# EAGLE design interface visual (EAGLE 7.6.0)
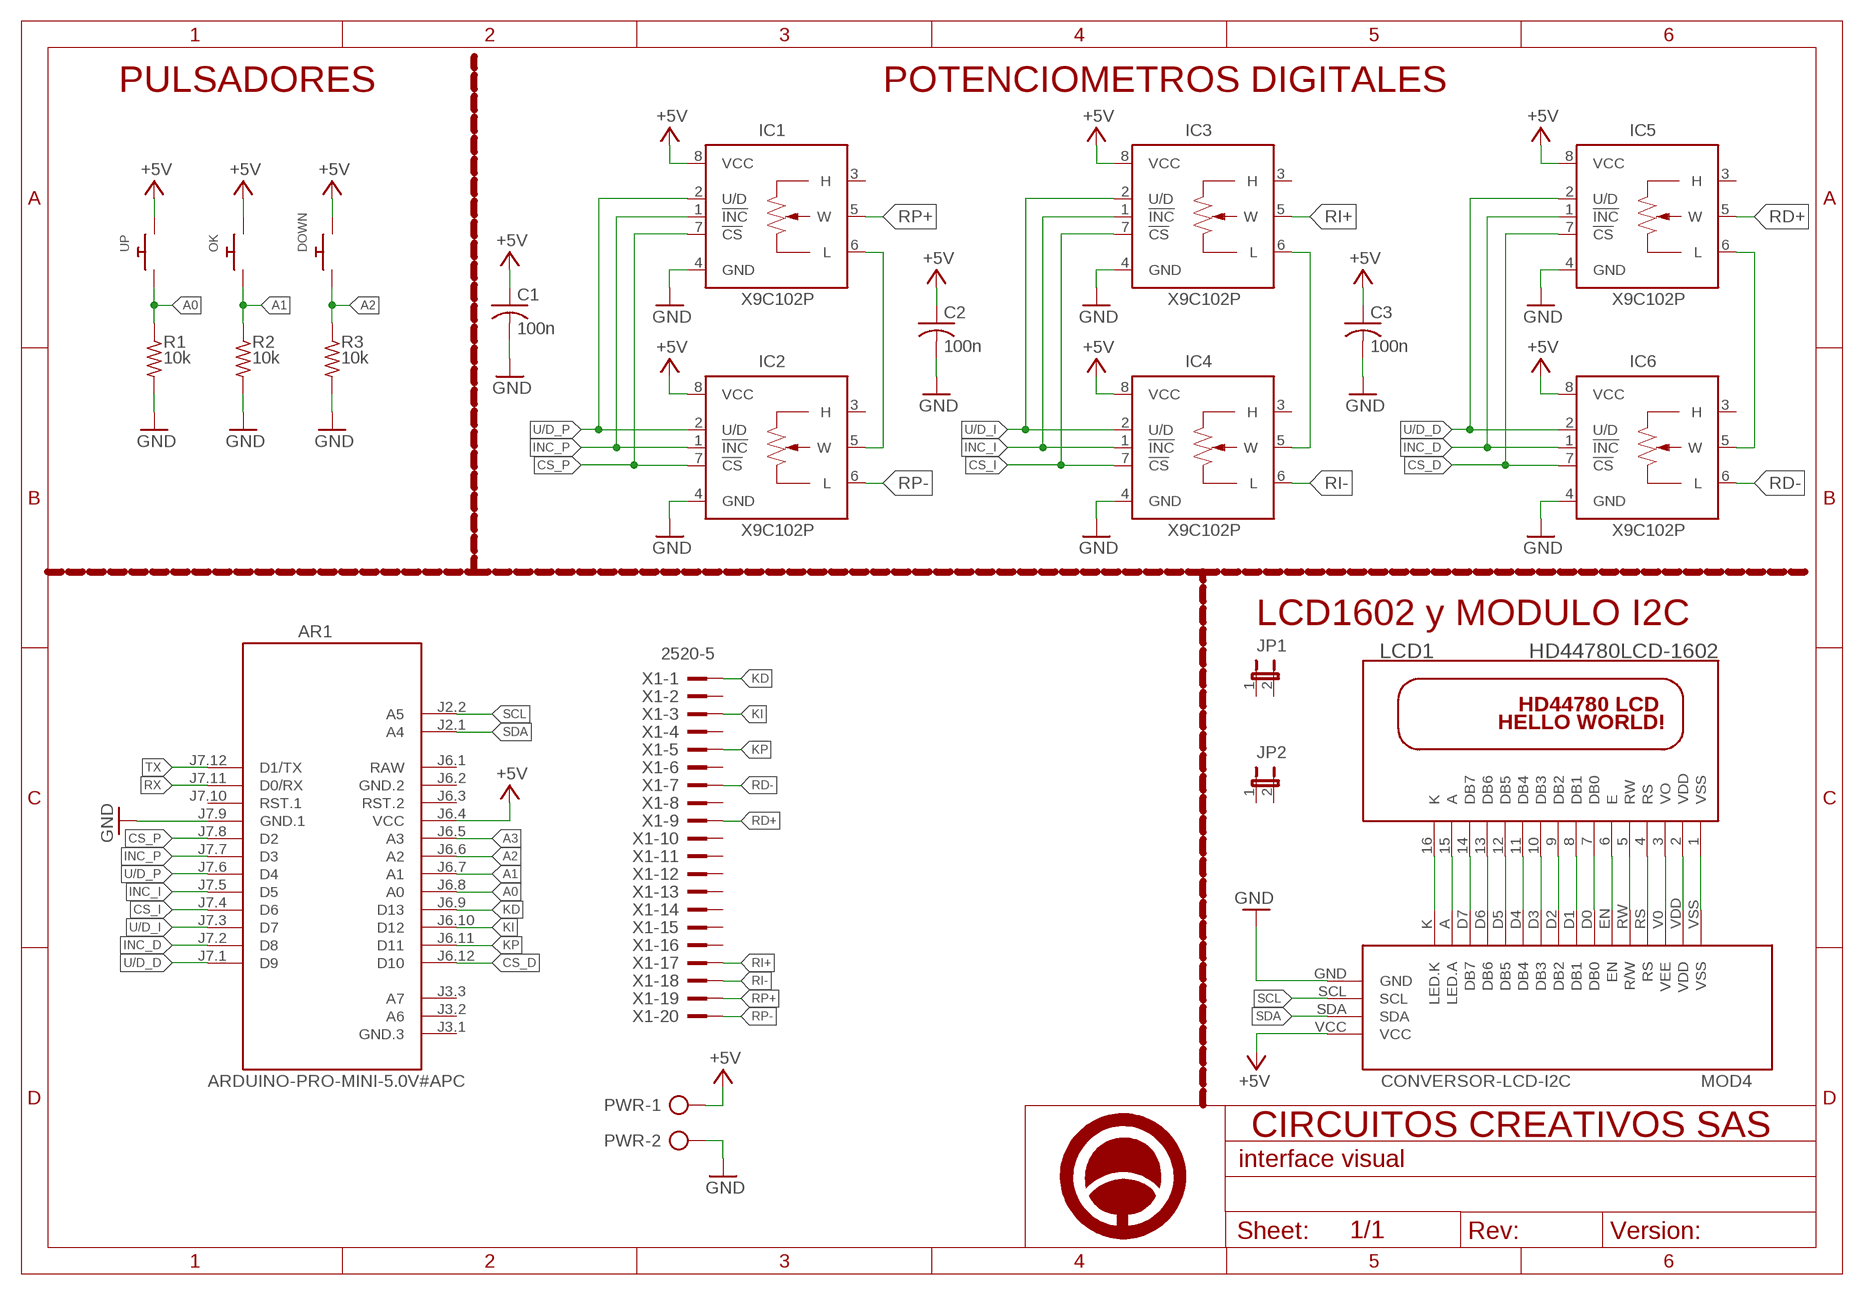
[diagram p0: schematic, sheet 1]

## Parts
AR1  ARDUINO-PRO-MINI-5.0V#APC  [ARDUINO-PRO-MINI#APC]
C1  100n  C-US025-025X050  [C025-025X050]
C2  100n  C-US025-025X050  [C025-025X050]
C3  100n  C-US025-025X050  [C025-025X050]
DOWN  SWITCH_PUSHBUTTONEVQ-PE  [TACT_PANA-EVQ]
IC1  X9C102P  [DIL08]
IC2  X9C102P  [DIL08]
IC3  X9C102P  [DIL08]
IC4  X9C102P  [DIL08]
IC5  X9C102P  [DIL08]
IC6  X9C102P  [DIL08]
JP1  JP1E  [JP1]
JP2  JP1E  [JP1]
LCD1  HD44780LCD-1602  [LCD1602]
MOD4  CONVERSOR-LCD-I2C  [CONVERSOR-LCD-I2C]
OK  SWITCH_PUSHBUTTONEVQ-PE  [TACT_PANA-EVQ]
PWR  AK500/2  [AK500/2]
R1  10k  R-US_0204/7  [0204/7]
R2  10k  R-US_0204/7  [0204/7]
R3  10k  R-US_0204/7  [0204/7]
U$1  A4_HORIZONTAL  [LOGO]
UP  SWITCH_PUSHBUTTONEVQ-PE  [TACT_PANA-EVQ]
X1  2520-5  [PAK100/2500-5-20]

## Nets
+5V: AR1.J6.4(VCC) C1.1 C2.1 C3.1 DOWN.P$2 IC1.8(VCC) IC2.8(VCC) IC3.8(VCC) IC4.8(VCC) IC5.8(VCC) IC6.8(VCC) MOD4.VCC OK.P$2 PWR.1 UP.P$2
A0: AR1.J6.8(A0) R1.1 UP.P$1
A1: AR1.J6.7(A1) OK.P$1 R2.1
A2: AR1.J6.6(A2) DOWN.P$1 R3.1
A3: AR1.J6.5(A3)
CS_D: AR1.J6.12(D10) IC5.7(!CS) IC6.7(!CS)
CS_I: AR1.J7.4(D6) IC3.7(!CS) IC4.7(!CS)
CS_P: AR1.J7.8(D2) IC1.7(!CS) IC2.7(!CS)
GND: AR1.J7.9(GND.1) C1.2 C2.2 C3.2 IC1.4(GND) IC2.4(GND) IC3.4(GND) IC4.4(GND) IC5.4(GND) IC6.4(GND) MOD4.GND PWR.2 R1.2 R2.2 R3.2
INC_D: AR1.J7.2(D8) IC5.1(!INC) IC6.1(!INC)
INC_I: AR1.J7.5(D5) IC3.1(!INC) IC4.1(!INC)
INC_P: AR1.J7.7(D3) IC1.1(!INC) IC2.1(!INC)
KD: AR1.J6.9(D13) X1.1
KI: AR1.J6.10(D12) X1.3
KP: AR1.J6.11(D11) X1.5
N$1: IC3.6(L) IC4.5(W)
N$2: IC1.6(L) IC2.5(W)
N$20: IC5.6(L) IC6.5(W)
N$34: LCD1.3(VO) MOD4.V0(VEE)
N$35: LCD1.4(RS) MOD4.RS
N$36: LCD1.5(RW) MOD4.RW(R/W)
N$37: LCD1.7(DB0) MOD4.D0(DB0)
N$38: LCD1.6(E) MOD4.EN
N$39: LCD1.8(DB1) MOD4.D1(DB1)
N$40: LCD1.9(DB2) MOD4.D2(DB2)
N$41: LCD1.10(DB3) MOD4.D3(DB3)
N$42: LCD1.11(DB4) MOD4.D4(DB4)
N$43: LCD1.12(DB5) MOD4.D5(DB5)
N$44: LCD1.13(DB6) MOD4.D6(DB6)
N$45: LCD1.14(DB7) MOD4.D7(DB7)
N$46: LCD1.15(A) MOD4.A(LED.A)
N$47: LCD1.16(K) MOD4.K(LED.K)
RD+: IC5.5(W) X1.9
RD-: IC6.6(L) X1.7
RI+: IC3.5(W) X1.17
RI-: IC4.6(L) X1.18
RP+: IC1.5(W) X1.19
RP-: IC2.6(L) X1.20
RX: AR1.J7.11(D0/RX)
SCL: AR1.J2.2(A5) MOD4.SCL
SDA: AR1.J2.1(A4) MOD4.SDA
TX: AR1.J7.12(D1/TX)
U/D_D: AR1.J7.1(D9) IC5.2(U/D) IC6.2(U/D)
U/D_I: AR1.J7.3(D7) IC3.2(U/D) IC4.2(U/D)
U/D_P: AR1.J7.6(D4) IC1.2(U/D) IC2.2(U/D)
VDD: LCD1.2(VDD) MOD4.VDD
VSS: LCD1.1(VSS) MOD4.VSS
Unconnected: AR1.J3.1(GND.3) AR1.J3.2(A6) AR1.J3.3(A7) AR1.J6.3(RST.2) AR1.J7.10(RST.1) IC1.3(H) IC2.3(H) IC3.3(H) IC4.3(H) IC5.3(H) IC6.3(H) JP1.1 JP1.2 JP2.1 JP2.2 X1.2 X1.4 X1.6 X1.8 X1.10 X1.11 X1.12 X1.13 X1.14 X1.15 X1.16

## Notes on the sheet
- PULSADORES | POTENCIOMETROS DIGITALES
- LCD1602 y MODULO I2C

## Power pins joined to a net without a drawn wire
GND.2: AR1.J6.2(GND.2)
RAW: AR1.J6.1(RAW)

## Library data of the parts
AR1 = DIY- comercial modules:ARDUINO-PRO-MINI-*#APC: Arduino Pro Mini (and compatible devices) with angle programming connector More details available here: https://www.arduino.cc/en/Main/ArduinoBoardProMini Click here to find device on ebay.com <http://www.ebay.com/sch/arduino+pro+mini>
C1-C3 = rcl:C-US: CAPACITOR, American symbol
DOWN OK UP = adafruit:SWITCH_PUSHBUTTON: Buttons SOFTTOUCHSMD_SJ - Soft touch temporary push button (Super Junk Akihabara) Compatible with SKPMANE010 [Mouser: 688-SKPMAN] C&K_KSS = Digikey: KSS221GLFS
IC1-IC6 = pot-xicor:X9C102*: Digital POTENTIOMETER; MF: INTERSIL; MPN: X9C102P; OC_FARNELL: 1216104; OC_NEWARK: 51J6928
JP1 JP2 = jumper:JP1E: JUMPER
LCD1 = adafruit:HD44780LCD: HD44780 LCD Standard character type LCDs, available in sizes from 8x1 to 40x4!
MOD4 = Ciruitos-Creativos-Modulos:CONVERSOR-LCD-I2C
PWR = con-ptr500:AK500/2: CONNECTOR; OC_FARNELL: unknown; OC_NEWARK: unknown
R1-R3 = resistor:R-US_: RESISTOR, American symbol
U$1 = Circuitos-Creativos-Estilos:A4_HORIZONTAL
X1 = con-3m:2520-: 3M (TM) Pak 100 4-Wall Header Source: 3M; MPN: D2520-5002-AR; OC_FARNELL: unknown; OC_NEWARK: 12P7058

## Board
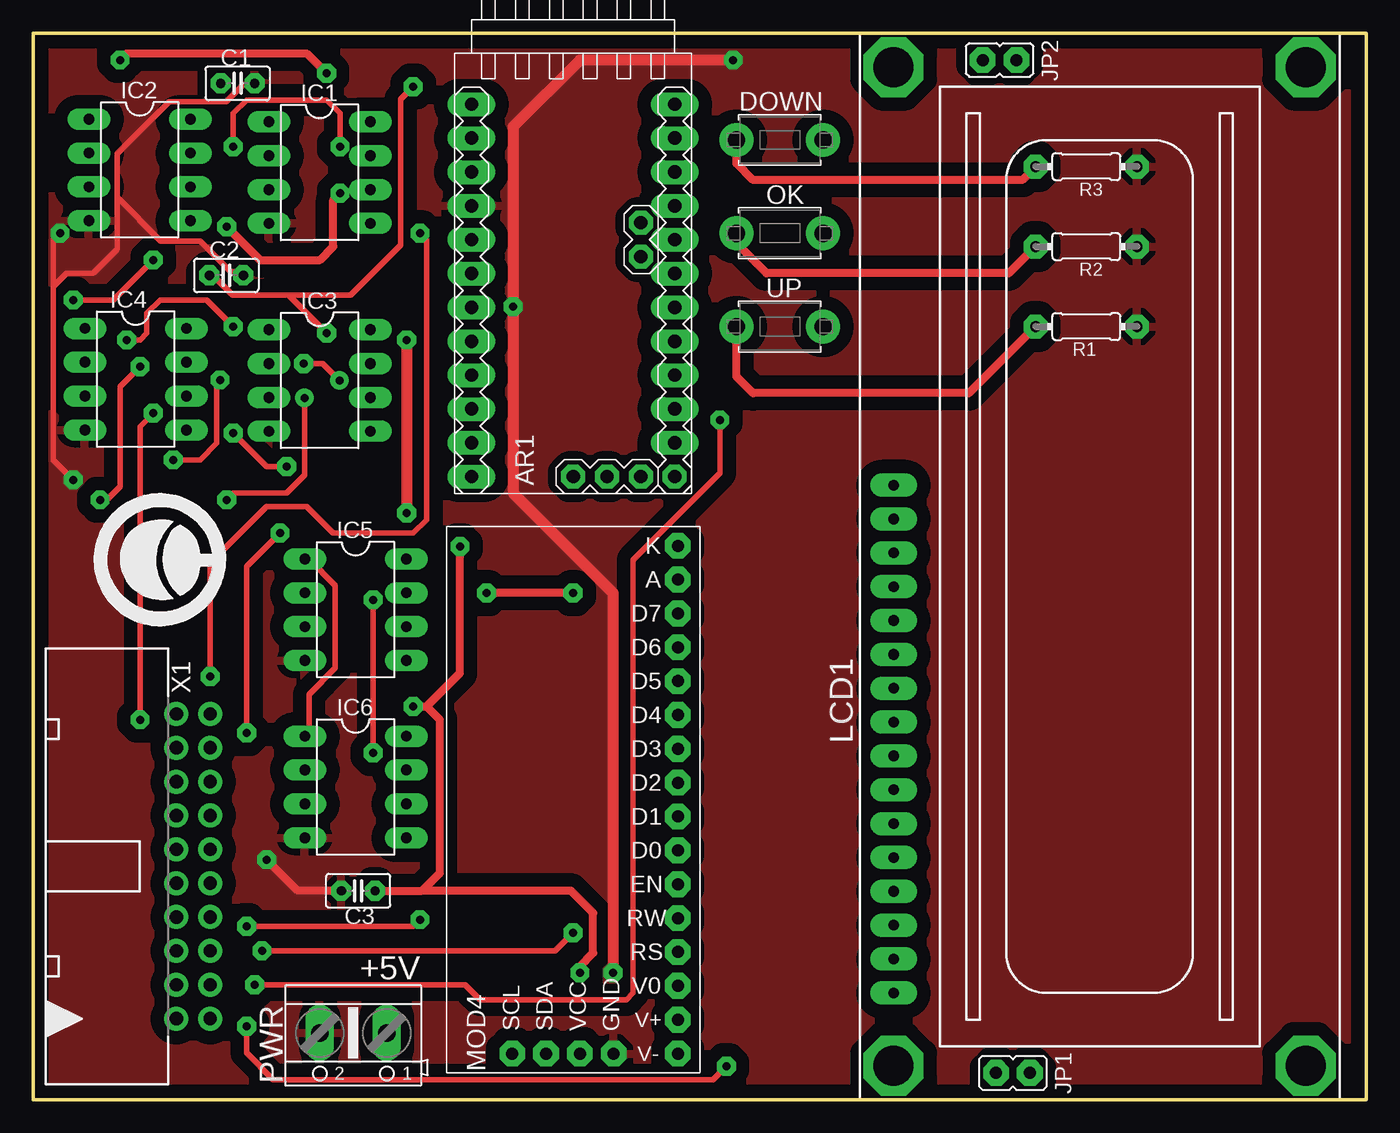
[diagram p1: board, top side]
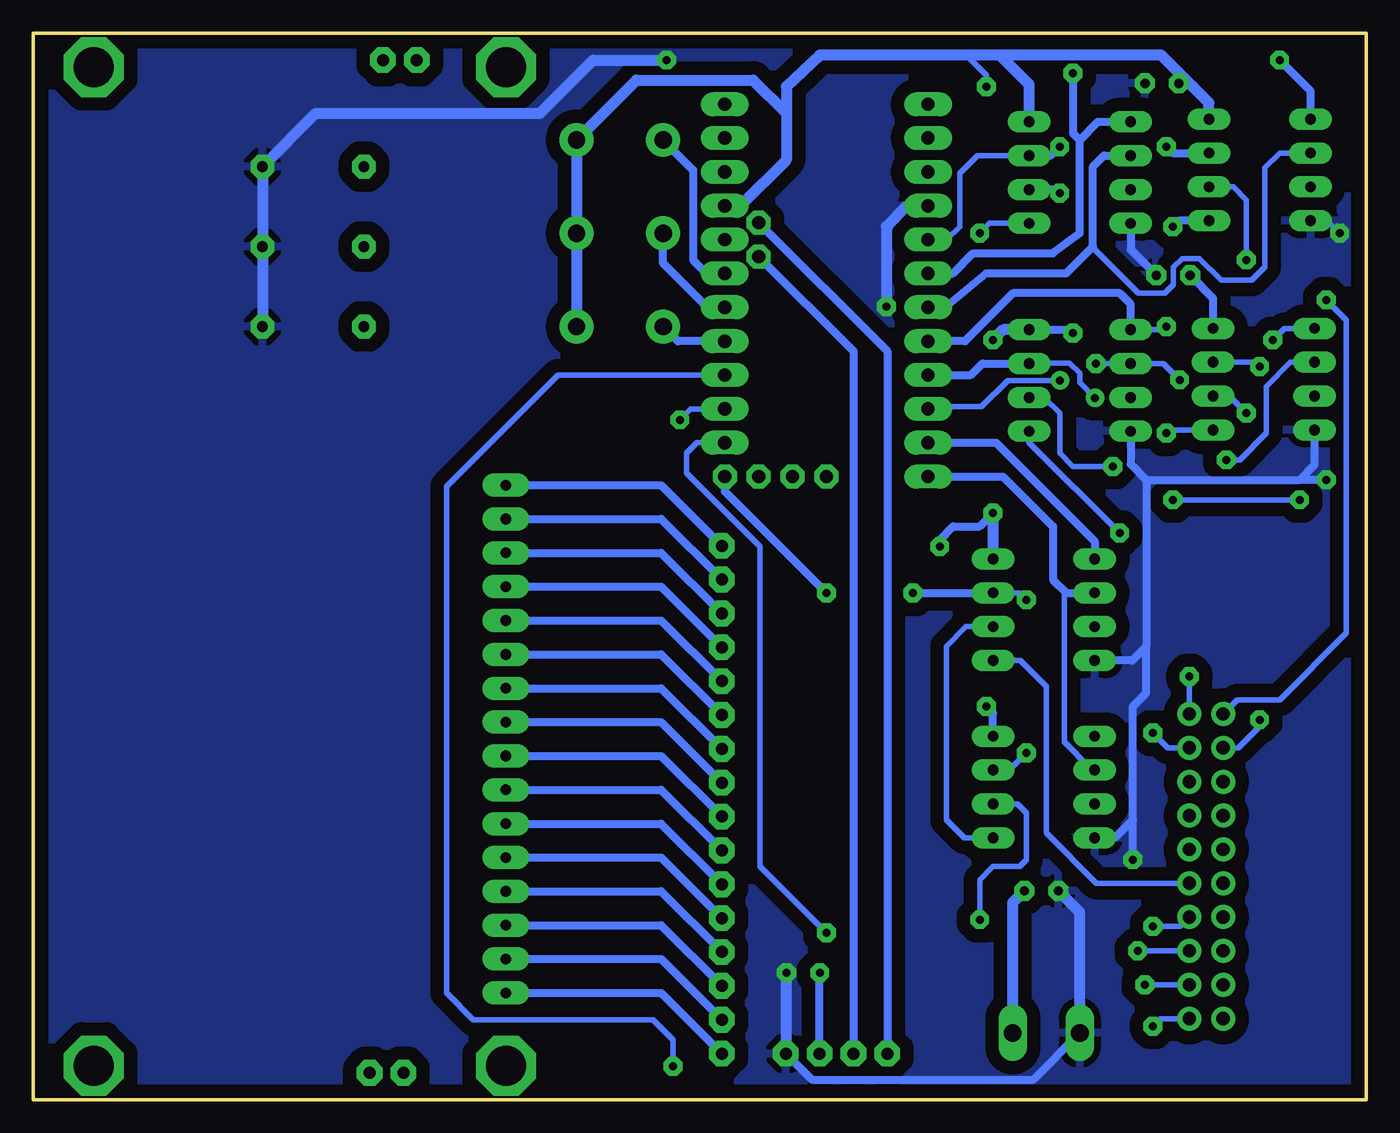
[diagram p2: board, bottom side, seen from below]

Size 100 x 80 mm. Coordinates in mm from the lower left corner, seen from the top.
Outline: 100,0 100,80 0,80 0,0 100,0
Copper layers (1*16): Top 0.035mm / dielectric 1.5mm / Bottom 0.035mm
Design rules "Circuitos_Creativos_2_capas": minimum track width 0.4mm, minimum drill 0.6mm, track to track 10mil, track to pad 10mil, pad to pad 10mil, via to via 10mil, smd to smd 8mil, copper to edge 1mm, drill to drill 15mil, minimum pad ring 0.4mm, minimum via ring 0.4mm, stop-mask expansion 4mil, vias tented up to drill 0mil, thermal gap 20mil

### Footprints (pad centres in the part's own frame; a part is rotated, then mirrored left to right if it is on the bottom)
ARDUINO-PRO-MINI#APC = drill 1 pad 1.676 octagon: J2.1 -1.27,5.08; J2.2 -3.81,5.08 | drill 1 pad 1.778 octagon: J3.1 15.24,0; J3.2 15.24,2.54; J3.3 15.24,5.08; J6.12 15.24,7.62 | drill 1 long: J6.1 -12.7,7.62; J6.2 -10.16,7.62; J6.3 -7.62,7.62; J6.4 -5.08,7.62; J6.5 -2.54,7.62; J6.6 0,7.62; J6.7 2.54,7.62; J6.8 5.08,7.62; J6.9 7.62,7.62; J6.10 10.16,7.62; J6.11 12.7,7.62; J7.1 15.24,-7.62; J7.2 12.7,-7.62; J7.3 10.16,-7.62; J7.4 7.62,-7.62; J7.5 5.08,-7.62; J7.6 2.54,-7.62; J7.7 0,-7.62; J7.8 -2.54,-7.62; J7.9 -5.08,-7.62; J7.10 -7.62,-7.62; J7.11 -10.16,-7.62; J7.12 -12.7,-7.62
C025-025X050 = drill 0.7 pad 1.422 octagon: 1 -1.27,0; 2 1.27,0
TACT_PANA-EVQ = drill 1.3 pad 2.54: P$1 -3.25,0; P$2 3.25,0
DIL08 = drill 0.813 long: 1 -3.81,-3.81; 2 -1.27,-3.81; 3 1.27,-3.81; 4 3.81,-3.81; 5 3.81,3.81; 6 1.27,3.81; 7 -1.27,3.81; 8 -3.81,3.81
JP1 = drill 0.9 pad 1.93 octagon: 1 0,-1.27; 2 0,1.27
LCD1602 = drill 0.8 pad 1.778 long: 1 8,33.46; 2 10.54,33.46; 3 13.08,33.46; 4 15.62,33.46; 5 18.16,33.46; 6 20.7,33.46; 7 23.24,33.46; 8 25.78,33.46; 9 28.32,33.46; 10 30.86,33.46; 11 33.4,33.46; 12 35.94,33.46; 13 38.48,33.46; 14 41.02,33.46; 15 43.56,33.46; 16 46.1,33.46 | drill 3 octagon: P1 2.54,33.46; P2 2.54,2.54; P3 77.46,2.54; P4 77.46,33.46
CONVERSOR-LCD-I2C = drill 0.9 pad 1.93 octagon: A -16.51,8.85; D0 3.81,8.85; D1 1.27,8.85; D2 -1.27,8.85; D3 -3.81,8.85; D4 -6.35,8.85; D5 -8.89,8.85; D6 -11.43,8.85; D7 -13.97,8.85; EN 6.35,8.85; GND 19.05,4.048; K -19.05,8.85; RS 11.43,8.85; RW 8.89,8.85; SCL 19.05,-3.572; SDA 19.05,-1.032; V0 13.97,8.85; VCC 19.05,1.508; VDD 16.51,8.85; VSS 19.05,8.85
AK500/2 = drill 1.321 long: 1 -2.515,0; 2 2.515,0
0204/7 = drill 0.8 pad 1.778 octagon: 1 -3.81,0; 2 3.81,0
PAK100/2500-5-20 = drill 1 pad 1.778: 1 -11.43,-1.27; 2 -11.43,1.27; 3 -8.89,-1.27; 4 -8.89,1.27; 5 -6.35,-1.27; 6 -6.35,1.27; 7 -3.81,-1.27; 8 -3.81,1.27; 9 -1.27,-1.27; 10 -1.27,1.27; 11 1.27,-1.27; 12 1.27,1.27; 13 3.81,-1.27; 14 3.81,1.27; 15 6.35,-1.27; 16 6.35,1.27; 17 8.89,-1.27; 18 8.89,1.27; 19 11.43,-1.27; 20 11.43,1.27

### Placement (x,y rotation side)
AR1  40.5,61.98 270 top
C1  15.33,76.25 0 top
C2  14.48,61.84 0 top
C3  24.37,15.66 180 top
DOWN  56,72 0 top
IC1  21.48,69.55 270 top
IC2  7.98,69.75 270 top
IC3  21.48,53.95 270 top
IC4  7.68,54.05 270 top
IC5  24.18,36.75 270 top
IC6  24.18,23.45 270 top
JP1  73.5,2 90 top
JP2  72.5,78 90 top
LCD1  98,0 90 top
MOD4  39.5,22.5 270 top
OK  56,65 0 top
PWR  24,5 180 top
R1  79,58 0 top
R2  79,64 0 top
R3  79,70 0 top
U$1  9.5,40.5 90 top
UP  56,58 0 top
X1  12,17.5 90 top

### Tracks (layer width: path | path; a pad name or v marks a point on that pad's centre or on a via)
+5V  (via drill 0.6 pad 1.42)
  Top 0.4: 14.94,60.34 13.48,61.8 C2.1 | 27.54,71.29 27.54,64.09 23.79,60.34
  Top 0.406: 27.54,71.29 27.54,75.04 v28.5,76 | 14.94,60.34 19.16,60.34 | 19.16,60.34 v22,57.5 | 23.79,60.34 19.16,60.34
  Top 0.61: v28.5,29.5 29.5,29.5 | 29.5,29.5 32,32 v32,41.5 | C3.1 29.16,15.66 | 29.16,15.66 30.5,17 30.5,28.5 29.5,29.5 | v41,9.5 41,10 42,11 42,14 40.34,15.66 29.16,15.66
  Top 0.813: v28,57 v28,44
  Bottom 0.406: v28.5,76 28.5,76.88 30,78.38
  Bottom 0.61: C2.1 11.49,60.12 IC4.8 | 27.88,78.38 28,78.38 | 13.25,76.25 13,76 | IC3.8 22.26,57.76 v22,57.5 | IC6.8 27.99,28.99 v28.5,29.5 | v32,41.5 32,42 31,43 29,43 v28,44 | MOD4.VCC v41.01,9.49 v41,9.5
  Bottom 0.813: PWR.1 26.52,14.79 C3.1 | 28,78.38 30,78.38 41,78.38 43.5,76 43.5,74 | 43.5,74 43.5,70.5 46.94,67.06 AR1.J6.4 | IC3.8 27.24,57.76 v28,57 | v28,44 IC5.8 | IC2.8 11.79,74.79 13,76 15.38,78.38 27.5,78.38 | 27.5,78.38 27.88,78.38 | C1.1 13.25,76.25 | 27.5,78.38 25.29,76.17 IC1.8 | 43.5,74 46,76.5 54.75,76.5 DOWN.P$2 OK.P$2 UP.P$2
A0
  Top 0.61: R1.1 70.19,53 54,53 52.75,54.25 UP.P$1
  Bottom 0.61: AR1.J6.8 51.65,56.9 UP.P$1
A1
  Top 0.61: R2.1 73.19,62 55,62 52.75,64.25 OK.P$1
  Bottom 0.61: AR1.J6.7 49.44,59.44 52.75,62.75 OK.P$1
A2
  Top 0.61: R3.1 74.19,69 54,69 52.75,70.25 DOWN.P$1
  Bottom 0.61: DOWN.P$1 50.5,69.75 50.5,63 49.48,61.98 AR1.J6.6
CS_D  (via drill 0.6 pad 1.42)
  Top 0.406: v25.5,37.5 v25.5,26
  Top 0.61: v40.5,38 v34,38
  Bottom 0.406: IC6.7 26.78,24.72 v25.5,26 | v25.5,37.5 26.02,38.02 IC5.7
  Bottom 0.61: AR1.J6.12 48.12,45.62 v40.5,38 | v34,38 28.01,38 IC5.7
CS_I  (via drill 0.6, 0.6 pad 1.42)
  Top 0.406: v20.35,52.65 20.35,46.85 19,45.5 15,45.5 v14.5,45 | v5,45 5.5,45 6.5,46 6.5,53.5 v8,55
  Bottom 0.4: 25.25,55.26 IC3.7
  Bottom 0.406: 25.25,55.26 22.26,55.26 21.5,54.5 21.5,53.8 v20.35,52.65 | v14.5,45 v5,45 | v8,55 8.32,55.32 IC4.7
  Bottom 0.61: AR1.J7.4 29.64,54.36 28.78,55.22 IC3.7
CS_P  (via drill 0.6 pad 1.42)
  Top 0.406: v23,71.5 23,74 22,75 16,75 15,74 v15,71.5
  Bottom 0.406: AR1.J7.8 31.48,64.52 30.5,65.5 30.5,69.5 29.18,70.82 IC1.7
  Bottom 0.61: IC1.7 23.68,70.82 v23,71.5 | v15,71.5 14.52,71.02 IC2.7
GND  (via drill 0.6, 0.6 pad 1.42)
  Top 0.4: C1.2 16.43,76.19 15.77,76.19 14.46,74.88 10.21,74.88 6.29,70.96 6.29,67.69 9.56,64.42 12.5,64.42 14.79,62.13 15.44,62.13 C2.2
  Top 0.406: v3,46.5 1.5,48 1.5,61 | v2,65 1.5,64.5 1.5,61 | 6.29,67.69 6.29,63.79 4.5,62 2.5,62 1.5,61
  Top 0.61: C3.2 19.84,15.66 v17.5,18
  Top 0.813: v43.5,9.5 43.5,38 36,45.5 v36,59.5 36,73 41,78 v52.5,78
  Bottom 0.406: IC2.4 2.94,65.94 v2,65
  Bottom 0.61: IC1.4 17.67,63.76 C2.2 | MOD4.GND 41.6,1.5 24.98,1.5 PWR.2 | IC3.4 17.67,47.67 16.5,46.5 | 16.5,46.5 5,46.5 | 5,46.5 3.87,47.63 IC4.4 | v3,46.5 5,46.5 | 16.5,46.5 16.5,34 | 16.5,34 17.56,32.94 IC5.4 | IC6.4 18.86,19.64 17.5,21 | 17.5,21 17.5,29.5 16.5,30.5 16.5,34 | v17.5,18 17.5,21
  Bottom 0.813: PWR.2 21.48,14.04 C3.2 | AR1.J7.9 34.44,67.06 36,65.5 v36,59.5 | v43.5,9.5 43.55,9.45 MOD4.GND | R1.2 R2.2 R3.2 78.81,74 62,74 58,78 v52.5,78
  pour Bottom (isolate 1.016): -1,-1 101,-1 101,81 -1,81
  pour Top (isolate 1.016): -2,-2 102,-2 102,82 -2,82
INC_D
  Top 0.4: IC6.1 20.68,27.47 20.68,30.41 22.64,32.37 22.64,38.59 20.68,40.55 IC5.1
  Bottom 0.61: AR1.J7.2 27.78,49.28 20.37,41.87 IC5.1
INC_I  (via drill 0.6 pad 1.42)
  Top 0.406: v7,57 8,57 8.5,57.5 8.5,59 9.5,60 13,60 v15,58
  Bottom 0.406: IC4.1 6.14,57.86 v7,57 | v15,58 15.24,57.76 IC3.1
  Bottom 0.61: IC3.1 17.67,59.67 18.5,60.5 26.5,60.5 30.1,56.9 AR1.J7.5
INC_P  (via drill 0.6 pad 1.42)
  Top 0.61: v6.5,78 7,78.5 20.5,78.5 v22,77
  Bottom 0.61: AR1.J7.7 31.02,61.98 29.5,63.5 23.5,63.5 21.5,65 21.5,72 | 21.5,72 20.14,73.36 IC1.1 | IC2.1 4.17,75.67 v6.5,78 | v22,77 22,72.5 21.5,72
KD  (via drill 0.6 pad 1.42)
  Top 0.406: v16,5.5 16,3.5 18,1.5 51,1.5 v52,2.5
  Bottom 0.406: AR1.J6.9 60.64,54.36 69,46 69,8 67,6 57.5,6 57,6 53.5,6 52,4.5 v52,2.5 | X1.1 15.43,6.07 v16,5.5
KI  (via drill 0.6 pad 1.42)
  Top 0.406: v51.5,51 51.5,47 45,40.5 45,8 44.5,7.5 33.5,7.5 32.39,8.61 v16.61,8.61
  Bottom 0.406: AR1.J6.10 50.68,51.82 v51.5,51 | v16.61,8.61 X1.3
KP  (via drill 0.6 pad 1.42)
  Top 0.406: v40.5,12.5 39.15,11.15 v17.15,11.15
  Bottom 0.406: AR1.J6.11 50.22,49.28 51,48.5 51,47 45.5,41.5 45.5,17.5 v40.5,12.5 | v17.15,11.15 X1.5
N$1  (via drill 0.6 pad 1.42)
  Top 0.406: v19,47.5 17.5,47.5 v15,50
  Bottom 0.406: IC3.6 24.18,52.68 23,51.5 23,48.5 22,47.5 v19,47.5 | v15,50 14.76,50.24 IC4.5
N$2  (via drill 0.6 pad 1.42)
  Top 0.61: v14.5,65.5 17,63 21.5,63 22.5,64 22.5,67.5 v23,68
  Bottom 0.61: IC2.5 14.06,65.94 v14.5,65.5 | v23,68 23.28,68.28 IC1.6
N$20
  Bottom 0.406: IC5.6 30.02,35.48 31.5,34 31.5,21 30.14,19.64 IC6.5
N$34
  Bottom 0.61: LCD1.3 52.9,13.08 MOD4.V0
N$35
  Bottom 0.61: LCD1.4 52.9,15.62 MOD4.RS
N$36
  Bottom 0.61: LCD1.5 52.9,18.16 MOD4.RW
N$37
  Bottom 0.61: LCD1.7 52.9,23.24 MOD4.D0
N$38
  Bottom 0.61: LCD1.6 52.9,20.7 MOD4.EN
N$39
  Bottom 0.61: LCD1.8 52.9,25.78 MOD4.D1
N$40
  Bottom 0.61: LCD1.9 52.9,28.32 MOD4.D2
N$41
  Bottom 0.61: LCD1.10 52.9,30.86 MOD4.D3
N$42
  Bottom 0.61: LCD1.11 52.9,33.4 MOD4.D4
N$43
  Bottom 0.61: LCD1.12 52.9,35.94 MOD4.D5
N$44
  Bottom 0.61: LCD1.13 52.9,38.48 MOD4.D6
N$45
  Bottom 0.61: LCD1.14 52.9,41.02 MOD4.D7
N$46
  Bottom 0.61: LCD1.15 52.9,43.56 MOD4.A
N$47
  Bottom 0.61: LCD1.16 52.9,46.1 MOD4.K
RD+
  Bottom 0.406: IC5.5 25.94,32.94 24,31 24,20 20.23,16.23 X1.9
RD-  (via drill 0.6 pad 1.42)
  Top 0.406: v29,13.5 28.5,13 v16,13
  Bottom 0.406: IC6.6 26.18,22.18 25.5,21.5 25.5,18 26,17.5 28,17.5 29,16.5 v29,13.5 | v16,13 13.96,13 X1.7
RI+  (via drill 0.6 pad 1.42)
  Top 0.406: v18.5,42.5 16,40 v16,27.5
  Bottom 0.406: IC3.5 25.29,49.29 v18.5,42.5 | v16,27.5 14.89,26.39 X1.17
RI-  (via drill 0.6 pad 1.42)
  Top 0.406: v9,51.5 8,50.5 v8,28.5
  Bottom 0.406: IC4.6 10.28,52.78 v9,51.5 | v8,28.5 8,28 9.61,26.39 X1.18
RP+  (via drill 0.6 pad 1.42)
  Top 0.406: v29,65 29.5,64.5 29.5,43.5 28.5,42.5 22.5,42.5 20.5,44.5 17.5,44.5 13.27,40.27 v13.27,31.73
  Bottom 0.406: IC1.5 28.26,65.74 v29,65 | v13.27,31.73 X1.19
RP-  (via drill 0.6 pad 1.42)
  Top 0.406: v9,63 6,60 v3,60
  Bottom 0.406: IC2.6 9.98,68.48 9,67.5 v9,63 | v3,60 1.5,58.5 1.5,35 6.5,30 9.66,30 X1.20
SCL
  Bottom 0.61: AR1.J2.2 35.93,56.14 MOD4.SCL
SDA
  Bottom 0.61: AR1.J2.1 38.47,56.14 MOD4.SDA
U/D_D
  Bottom 0.4: IC6.2 20.68,24.85 22.64,26.81 22.64,37.93 22.5,38
  Bottom 0.61: AR1.J7.1 27.24,46.74 23.5,43 23.5,39 22.5,38 20.39,38
  Bottom 0.813: 20.39,38 IC5.2
U/D_I  (via drill 0.6, 0.6 pad 1.42)
  Top 0.406: v20.28,55.22 21.7,55.22 v22.96,53.95 | v14,54 13.75,53.75 13.75,49.25 12.5,48 v10.5,48
  Bottom 0.4: v22.96,53.95 26.89,53.95 28.85,51.99 32.77,51.99 AR1.J7.3
  Bottom 0.406: v20.28,55.22 IC3.2 15.22,55.22 v14,54 | v10.5,48 9.5,48 7.5,50 7.5,53.5 5.68,55.32 IC4.2
U/D_P
  Bottom 0.4: 7.6,67.69 7.6,62.46 8.58,61.48 10.87,61.48 12.5,63.11 13.81,63.11 14.46,62.46 14.46,61.15 15.12,60.49 17.08,60.49 20.54,63.96
  Bottom 0.406: 7.6,67.69 7.6,69.9 6.48,71.02 IC2.2
  Bottom 0.61: AR1.J7.6 31.56,59.44 28.5,62 22.5,62 20.54,63.96 20.5,64 20.5,70 19.68,70.82 IC1.2
VDD
  Bottom 0.61: LCD1.2 52.9,10.54 MOD4.VDD
VSS
  Bottom 0.61: LCD1.1 52.9,8 MOD4.VSS

### Text on the board
tPlace: +5V